# Altium project EFR32xG22_LC_REF_DES_A02.PrjPCB
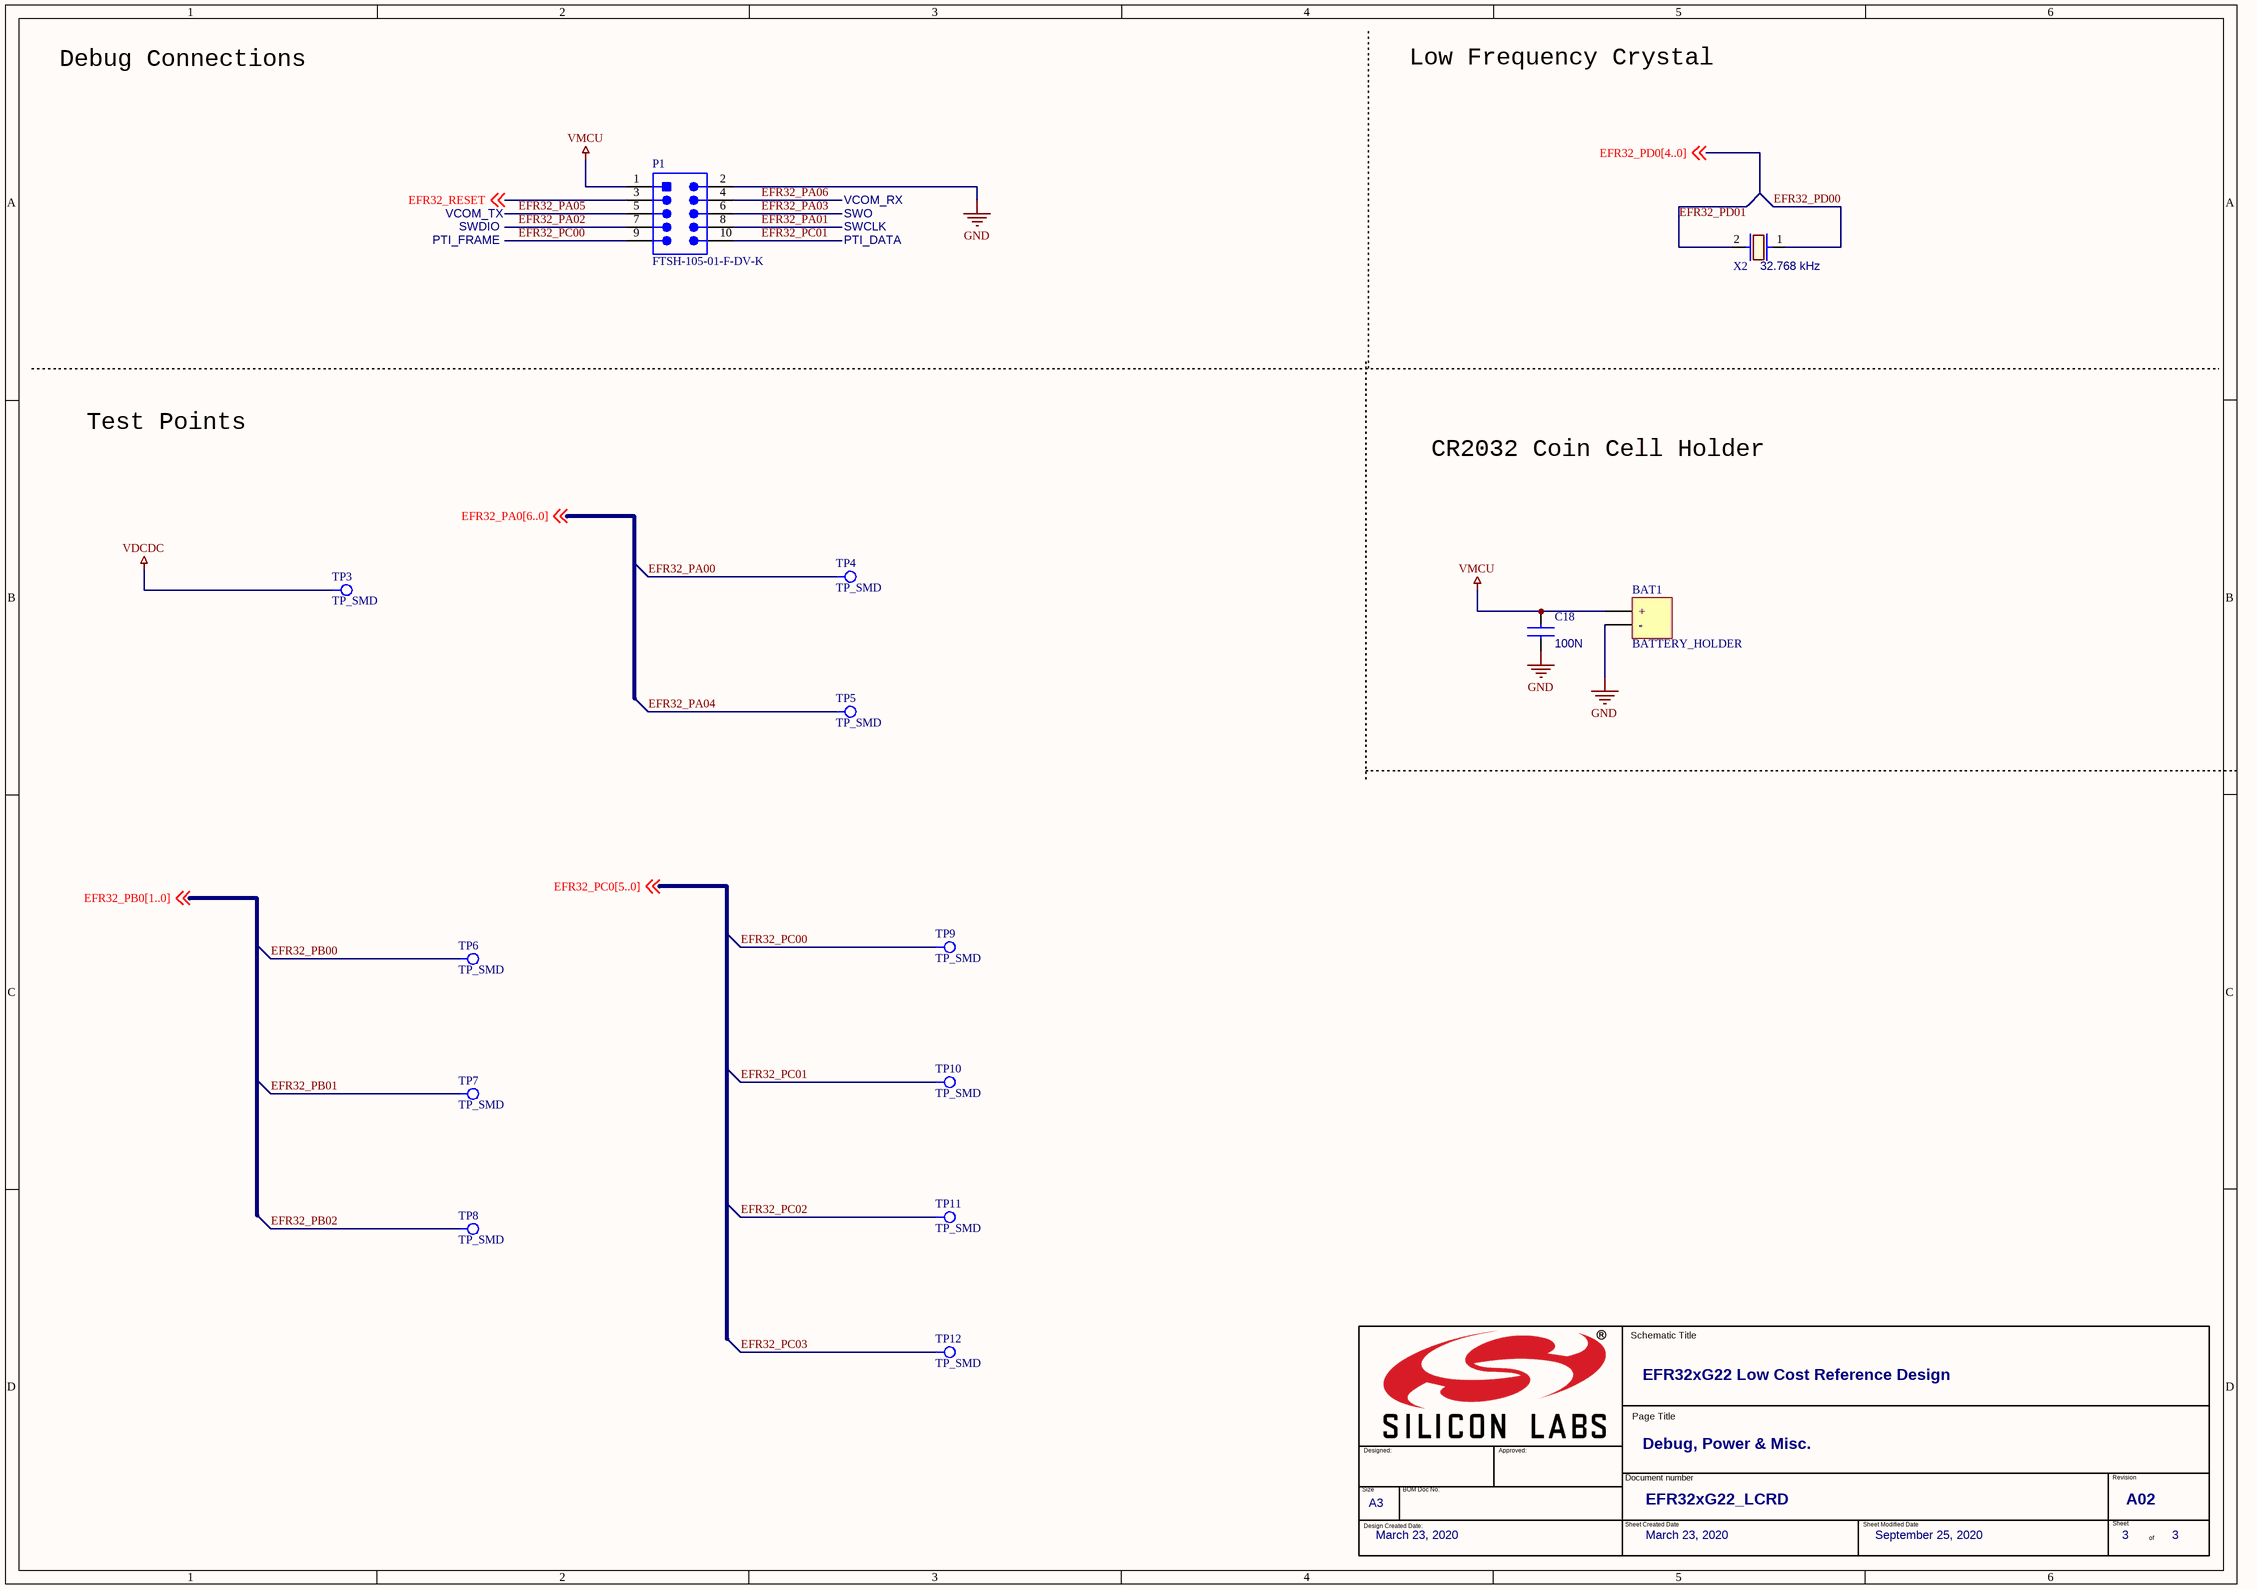
[diagram p0: EFR32xG22_LC_REF_DES_A02_TP_Connectors.SchDoc]
AssemblyPrintName: EFR32xG22_LC_REF_DES_A02_ASM; Board_No: EFR32xG22_LCRD; Board_Rev: A02; CamPrintName: EFR32xG22_LC_REF_DES_A01_CAM; ClassName: PCB Only; Company_Address_1: 343 Congress St; Company_Address_2: 4th Floor; Company_Address_3: Boston, MA 02210; Company_Design_Group: IoT Wireless Hardware Applications; Company_Tel: 617-951-0200; Company_Web_Site: www.silabs.com; FabPrintName: EFR32xG22_LC_REF_DES_A01_FAB; PCBLayoutName: EFR32xG22_LC_REF_DES_A01; SchematicName: EFR32xG22_LC_REF_DES_A02_SCH; Title: EFR32xG22 Low Cost Reference Design; VariantName: EFR32xG22_LC_REF_DES_A01; XYReportName: EFR32xG22_LC_REF_DES_A02_XYR
3 sheets, 57 parts. Net scope: global (net labels, ports and power ports of the same name join across sheets).
Board file: EFR32xG22_LC_REF_DES_A01.PcbDoc
Sheets:
  EFR32xG22_LC_REF_DES_A02_TP_Connectors.SchDoc
  EFR32xG22_LC_REF_DES_A02_Main.SchDoc
  EFR32xG22_LC_REF_DES_A02_Cover.SchDoc

## Sheet EFR32xG22_LC_REF_DES_A02_TP_Connectors.SchDoc: EFR32xG22 Low Cost Reference Design
size 420 x 297 mm

### Parts
(Parts that share a designator on the sheet are numbered #1, #2 ... from top to bottom, then left to right.)
*?#1  Page Title: Debug, Power & Misc.  Page Size: A3  Title: EFR32xG22 Low Cost Reference Design  Page Number: 3  (hidden comment: TitleBlock_EnergyMicro_A3)  (graphical)
BAT1  BATTERY_HOLDER
C18  100N  [C_0402]
P1  FTSH-105-01-F-DV-K  [SMTC-FTSH-105-01-L-DV-K_V]
TP3  TP_SMD  [TP]
TP4  TP_SMD  [TP]
TP5  TP_SMD  [TP]
TP6  TP_SMD  [TP]
TP7  TP_SMD  [TP]
TP8  TP_SMD  [TP]
TP9  TP_SMD  [TP]
TP10  TP_SMD  [TP]
TP11  TP_SMD  [TP]
TP12  TP_SMD  [TP]
X2  32.768 kHz  [LFXO]

### Nets
GND: BAT1.2(-) C18.2 P1.2
VDCDC: TP3.1(TP)
VMCU: BAT1.1(+) C18.1 P1.1
EFR32_PA00: TP4.1(TP)
EFR32_PA01: P1.8
EFR32_PA02: P1.7
EFR32_PA03: P1.6
EFR32_PA04: TP5.1(TP)
EFR32_PA05: P1.5
EFR32_PA06: P1.4
EFR32_PB00: TP6.1(TP)
EFR32_PB01: TP7.1(TP)
EFR32_PB02: TP8.1(TP)
EFR32_PC00: P1.9 TP9.1(TP)
EFR32_PC01: P1.10 TP10.1(TP)
EFR32_PC02: TP11.1(TP)
EFR32_PC03: TP12.1(TP)
EFR32_PD00: X2.1
EFR32_PD01: X2.2
EFR32_RESET: P1.3 ; off-sheet EFR32_RESET

### Notes on the sheet
- Debug Connections
- Low Frequency Crystal
- PTI_FRAME
- VCOM_TX
- SWDIO
- VCOM_RX
- SWO
- SWCLK
- PTI_DATA
- Test Points
- CR2032 Coin Cell Holder
- March 23, 2020
- EFR32xG22_LCRD
- September 25, 2020
- A02
- (in symbol TitleBlock_EnergyMicro_A3) Schematic Title; Page Title; Designed:; Approved:; Document number; Revision; Size; BOM Doc No:; Design Created Date:; Sheet Created Date; Sheet Modified Date; Sheet; of

### Library data of the parts
*?#1 = TitleBlock_EnergyMicro_A3: OrgName: Silicon Labs; Page Count: 3
C18 = C0201
P1 = CMP-2000-05352-1: Male Header, Pitch 1.27 mm, 2 x 5 Position, Height 6.12 mm, RoHS, Tube; Manufacturer: Samtec; Number of Positions: 10; Connector Type: Header,Shrouded; Number of Positions Loaded: All; Row Spacing: 0.050"(1.27mm); Fastening Type: -; Package Reference: FTSH-105-01-L-DV-K; Termination: Solder; Package URL: http://suddendocs.samtec.com/prints/ftsh-1xx-xx-xxx-dv-xxx-footprint.pdf; Number of Rows: 2; Contact Finish Thickness: 3µin(0.08µm); Contact Type: MalePin; Manufacturer URL: http://www.samtec.com/; Contact Mating Length: 0.120"(3.05mm); Pitch: 0.050"(1.27mm); Series: FTSH; Features: -; Contact Finish: Gold; Color: Black; Family: RectangularConnectors-Headers,MalePins; Datasheet URL: http://suddendocs.samtec.com/prints/ftsh-1xx-xx-xxx-dv-xxx-mkt.pdf; Package Description: Male Header, Pitch 1.27 mm, 2 x 5 Position, Height 5.97 mm, Tail Length 4.32 mm; Mounting Type: SurfaceMount; Datasheet Version: Rev. ET, 10/1995; Category: Connectors,Interconnects; Packaging: Tube
X2 = LFXO: Mfg #: CM8V-T1A, 32768Hz, 12.5pF, +/- 20ppm; Mfg: Micro Crystal AG; Price_1K: 0.3

## Sheet EFR32xG22_LC_REF_DES_A02_Main.SchDoc: EFR32xG22 Low Cost Reference Design
size 420 x 297 mm
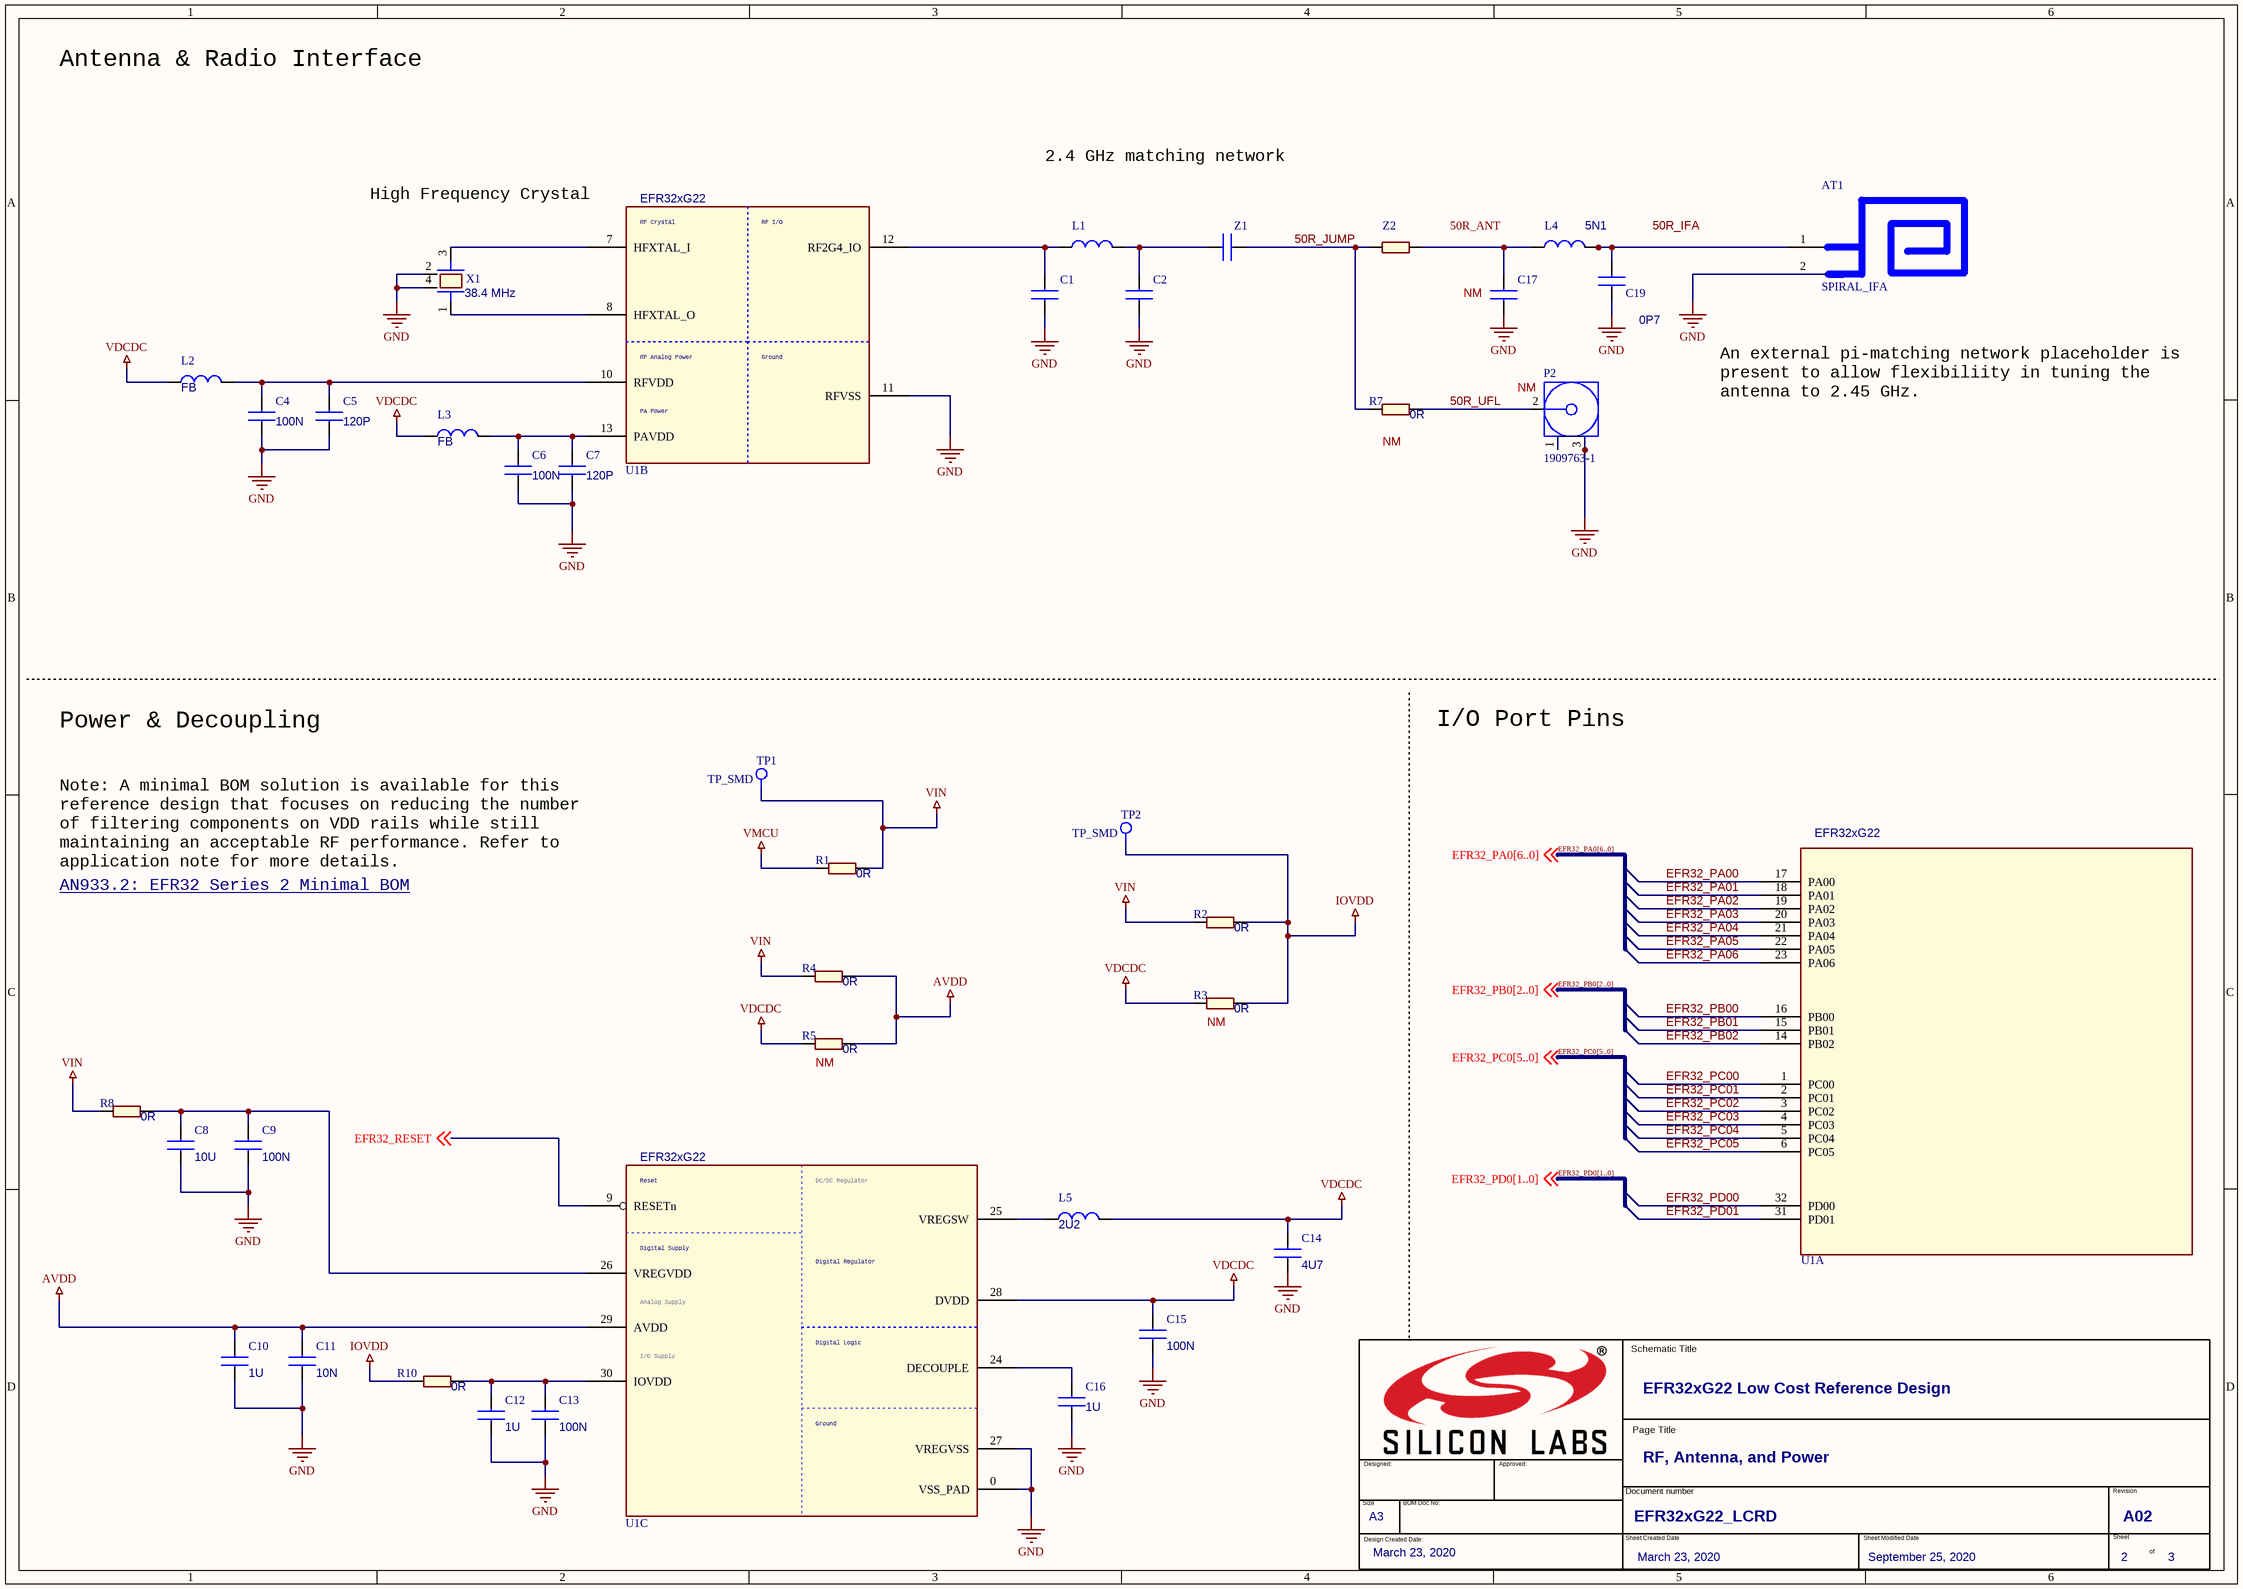
[diagram p1: EFR32xG22_LC_REF_DES_A02_Main.SchDoc]

### Parts
(Parts that share a designator on the sheet are numbered #1, #2 ... from top to bottom, then left to right.)
*?#2  Page Title: RF, Antenna, and Power  Page Size: A3  Title: EFR32xG22 Low Cost Reference Design  Page Number: 2  Page Count: 3  Design Create Date: March 23, 2020  (hidden comment: TitleBlock_EnergyMicro_A3)  (graphical)
AT1  SPIRAL_IFA  [SPIRAL_IFA_INV]
C1  (no value)  [0201]
C2  (no value)  [0201]
C4  100N  [C_0402]
C5  120P  [0201]
C6  100N  [C_0402]
C7  120P  [0201]
C8  10U  [0805]
C9  100N  [C_0402]
C10  1U  [C_0603]
C11  10N  [0201]
C12  1U  [C_0603]
C13  100N  [C_0402]
C14  4U7  [C_0603]
C15  100N  [C_0402]
C16  1U  [C_0603]
C17  1P3  [0201]  (value not drawn)
C19  0P7  [0201]
L1  (no value)  [0201]
L2  FB  [0402_Taiyo]
L3  FB  [0402_Taiyo]
L4  5N1  [0201]
L5  2U2  [L_0603]
P2  1909763-1  [TECO-1909763-1_V]
R1  0R  [0201]
R2  0R  [0201]
R3  0R  [0201]
R4  0R  [0201]
R5  0R  [0201]
R7  0R  [0201]
R8  0R  [0201]
R10  0R  [0201]
TP1  TP_SMD  [TP]
TP2  TP_SMD  [TP]
U1  EFR32xG22  [QFN32]  (parts A,B,C of 3)
X1  38.4 MHz  [HFXO_TZ2205E]
Z1  (no value)  [0201]
Z2  (no value)  [0201]

### Nets
AVDD: C10.1 C11.1 R4.2 R5.2 U1.29(AVDD)
GND: AT1.2(GND) C1.2 C2.2 C4.2 C5.2 C6.2 C7.2 C8.2 C9.2 C10.2 C11.2 C12.2 C13.2 C14.2 C15.2 C16.2 C17.2 C19.1 P2.1 P2.3 U1.0(VSS_PAD) U1.11(RFVSS) U1.27(VREGVSS) X1.2 X1.4
IOVDD: R2.2 R3.2 R10.1 TP2.1(TP)
VDCDC: C14.1 C15.1 L2.1 L3.1 L5.2 R3.1 R5.1 U1.28(DVDD)
VIN: R1.2 R2.1 R4.1 R8.1 TP1.1(TP)
VMCU: R1.1
50R_JUMP: R7.1 Z1.2 Z2.1
50R_UFL: P2.2 R7.2
EFR32_PA00: U1.17(PA00)
EFR32_PA01: U1.18(PA01)
EFR32_PA02: U1.19(PA02)
EFR32_PA03: U1.20(PA03)
EFR32_PA04: U1.21(PA04)
EFR32_PA05: U1.22(PA05)
EFR32_PA06: U1.23(PA06)
EFR32_PB00: U1.16(PB00)
EFR32_PB01: U1.15(PB01)
EFR32_PB02: U1.14(PB02)
EFR32_PC00: U1.1(PC00)
EFR32_PC01: U1.2(PC01)
EFR32_PC02: U1.3(PC02)
EFR32_PC03: U1.4(PC03)
EFR32_PC04: U1.5(PC04)
EFR32_PC05: U1.6(PC05)
EFR32_PD00: U1.32(PD00)
EFR32_PD01: U1.31(PD01)
EFR32_RESET: U1.9(RESETn) ; off-sheet EFR32_RESET
NetC1_1: C1.1 L1.1 U1.12(RF2G4_IO)
NetC2_1: C2.1 L1.2 Z1.1
NetC4_1: C4.1 C5.1 L2.2 U1.10(RFVDD)
NetC6_1: C6.1 C7.1 L3.2 U1.13(PAVDD)
NetC8_1: C8.1 C9.1 R8.2 U1.26(VREGVDD)
NetC12_1: C12.1 C13.1 R10.2 U1.30(IOVDD)
NetC16_1: C16.1 U1.24(DECOUPLE)
NetC17_1: C17.1 L4.1 Z2.2
NetC19_2: C19.2 L4.2
NetL5_1: L5.1 U1.25(VREGSW)
NetU1_7: U1.7(HFXTAL_I) X1.3
NetU1_8: U1.8(HFXTAL_O) X1.1

Not connected (* = marked no-connect by the designer): AT1 1(RF)

### Buses and harness runs
bus EFR32_PA0[6..0]
bus EFR32_PB0[2..0]
bus EFR32_PC0[5..0]
bus EFR32_PD0[1..0]

### Notes on the sheet
- Antenna & Radio Interface
- 2.4 GHz matching network
- High Frequency Crystal
- (near C17) NM
- (near P2) NM
- (near R7) NM
- An external pi-matching network placeholder is present to allow flexibiliity in tuning the antenna to 2.45 GHz.
- Power & Decoupling
- I/O Port Pins
- Note: A minimal BOM solution is available for this reference design that focuses on reducing the number of filtering components on VDD rails while still maintaining an acceptable RF performance. Refer to                                       application note for more details.
- AN933.2: EFR32 Series 2 Minimal BOM
- (near R5) NM
- (near R3) NM
- EFR32xG22_LCRD
- A02
- March 23, 2020
- September 25, 2020
- Labels drawn without touching a wire or pin: 50R_ANT, 50R_IFA
- (in symbol EFR32xG22-2.4GHZ-QFN32, part B) RF Crystal; RF I/O; RF Analog Power; Ground; PA Power
- (in symbol EFR32xG22-2.4GHZ-QFN32, part C) Reset; DC/DC Regulator; Digital Supply; Digital Regulator; Analog Supply; Digital Logic; I/O Supply; Ground
- (in symbol TitleBlock_EnergyMicro_A3) Schematic Title; Page Title; Designed:; Approved:; Document number; Revision; Size; BOM Doc No:; Design Created Date:; Sheet Created Date; Sheet Modified Date; Sheet; of

### Library data of the parts
*?#2 = TitleBlock_EnergyMicro_A3: OrgName: Silicon Labs
C1 C2 C11 C13 C15 C17 C19 Z1 = C0201
  C2 C17: Value: *
C4-C9 C12 C14 C16 = C0402
C10 = C0805
L1 L4 = L0201
L2 L3 L5 = L0402
P2 = CMP-2000-07505-1: Ultra Miniature Coaxial Connector Jack, 60 V, 50 Ohm, -40 to 90 degC, RoHS, Tape and Reel; Manufacturer: TE Connectivity; Gender: Female; PCB Mounting Orientation: Vertical; Body Material: LiquidCrystalPolymer; Case\/Package: SMD/SMT; Impedance: 50Ohm; Max Frequency: 6GHz; Body Plating: Gold; Dielectric Material: Polymer; Orientation: Straight; Mount: SurfaceMount; Length: 3mm; Packaging: TapeandReel; Connector Type: Jack; Lead Free: LeadFree; Package Quantity: 1; Termination: SMD/SMT; Contact Material: CopperAlloy; Fastening Type: Pull; RoHSCompliant: true; Max Operating Temperature: 90degC; Datasheet URL: http://www.te.com/commerce/DocumentDelivery/DDEController?Action=srchrtrv&DocNm=1909763&DocType=Customer+Drawing&DocLang=English; Contact Plating: Gold; Mounting Technology: SurfaceMount; Package Reference: TECO-1909763-1; Insulation Material: Thermoplastic; Min Operating Temperature: -40degC; Manufacturer URL: http://www.te.com/; ELV: Compliant; Datasheet Version: Rev. B2, 11/2015; Radiation Hardening: No; Package Description: 3-Pin Surface Mount Device, Body 2.6 x 2.6 mm; Housing Colour: Beige
R1-R5 R7 R8 R10 Z2 = R0201: Price_1K: 0.005
U1 = EFR32xG22-2.4GHZ-QFN32: MFG: Silicon Labs; MFG #: <val>
X1 = HFXO: Mfg #: KDS_DSX211SH_2016; Mfg: KDS; Price_1K: 0.512

## Sheet EFR32xG22_LC_REF_DES_A02_Cover.SchDoc: EFR32xG22 Low Cost Reference Design
size 420 x 297 mm
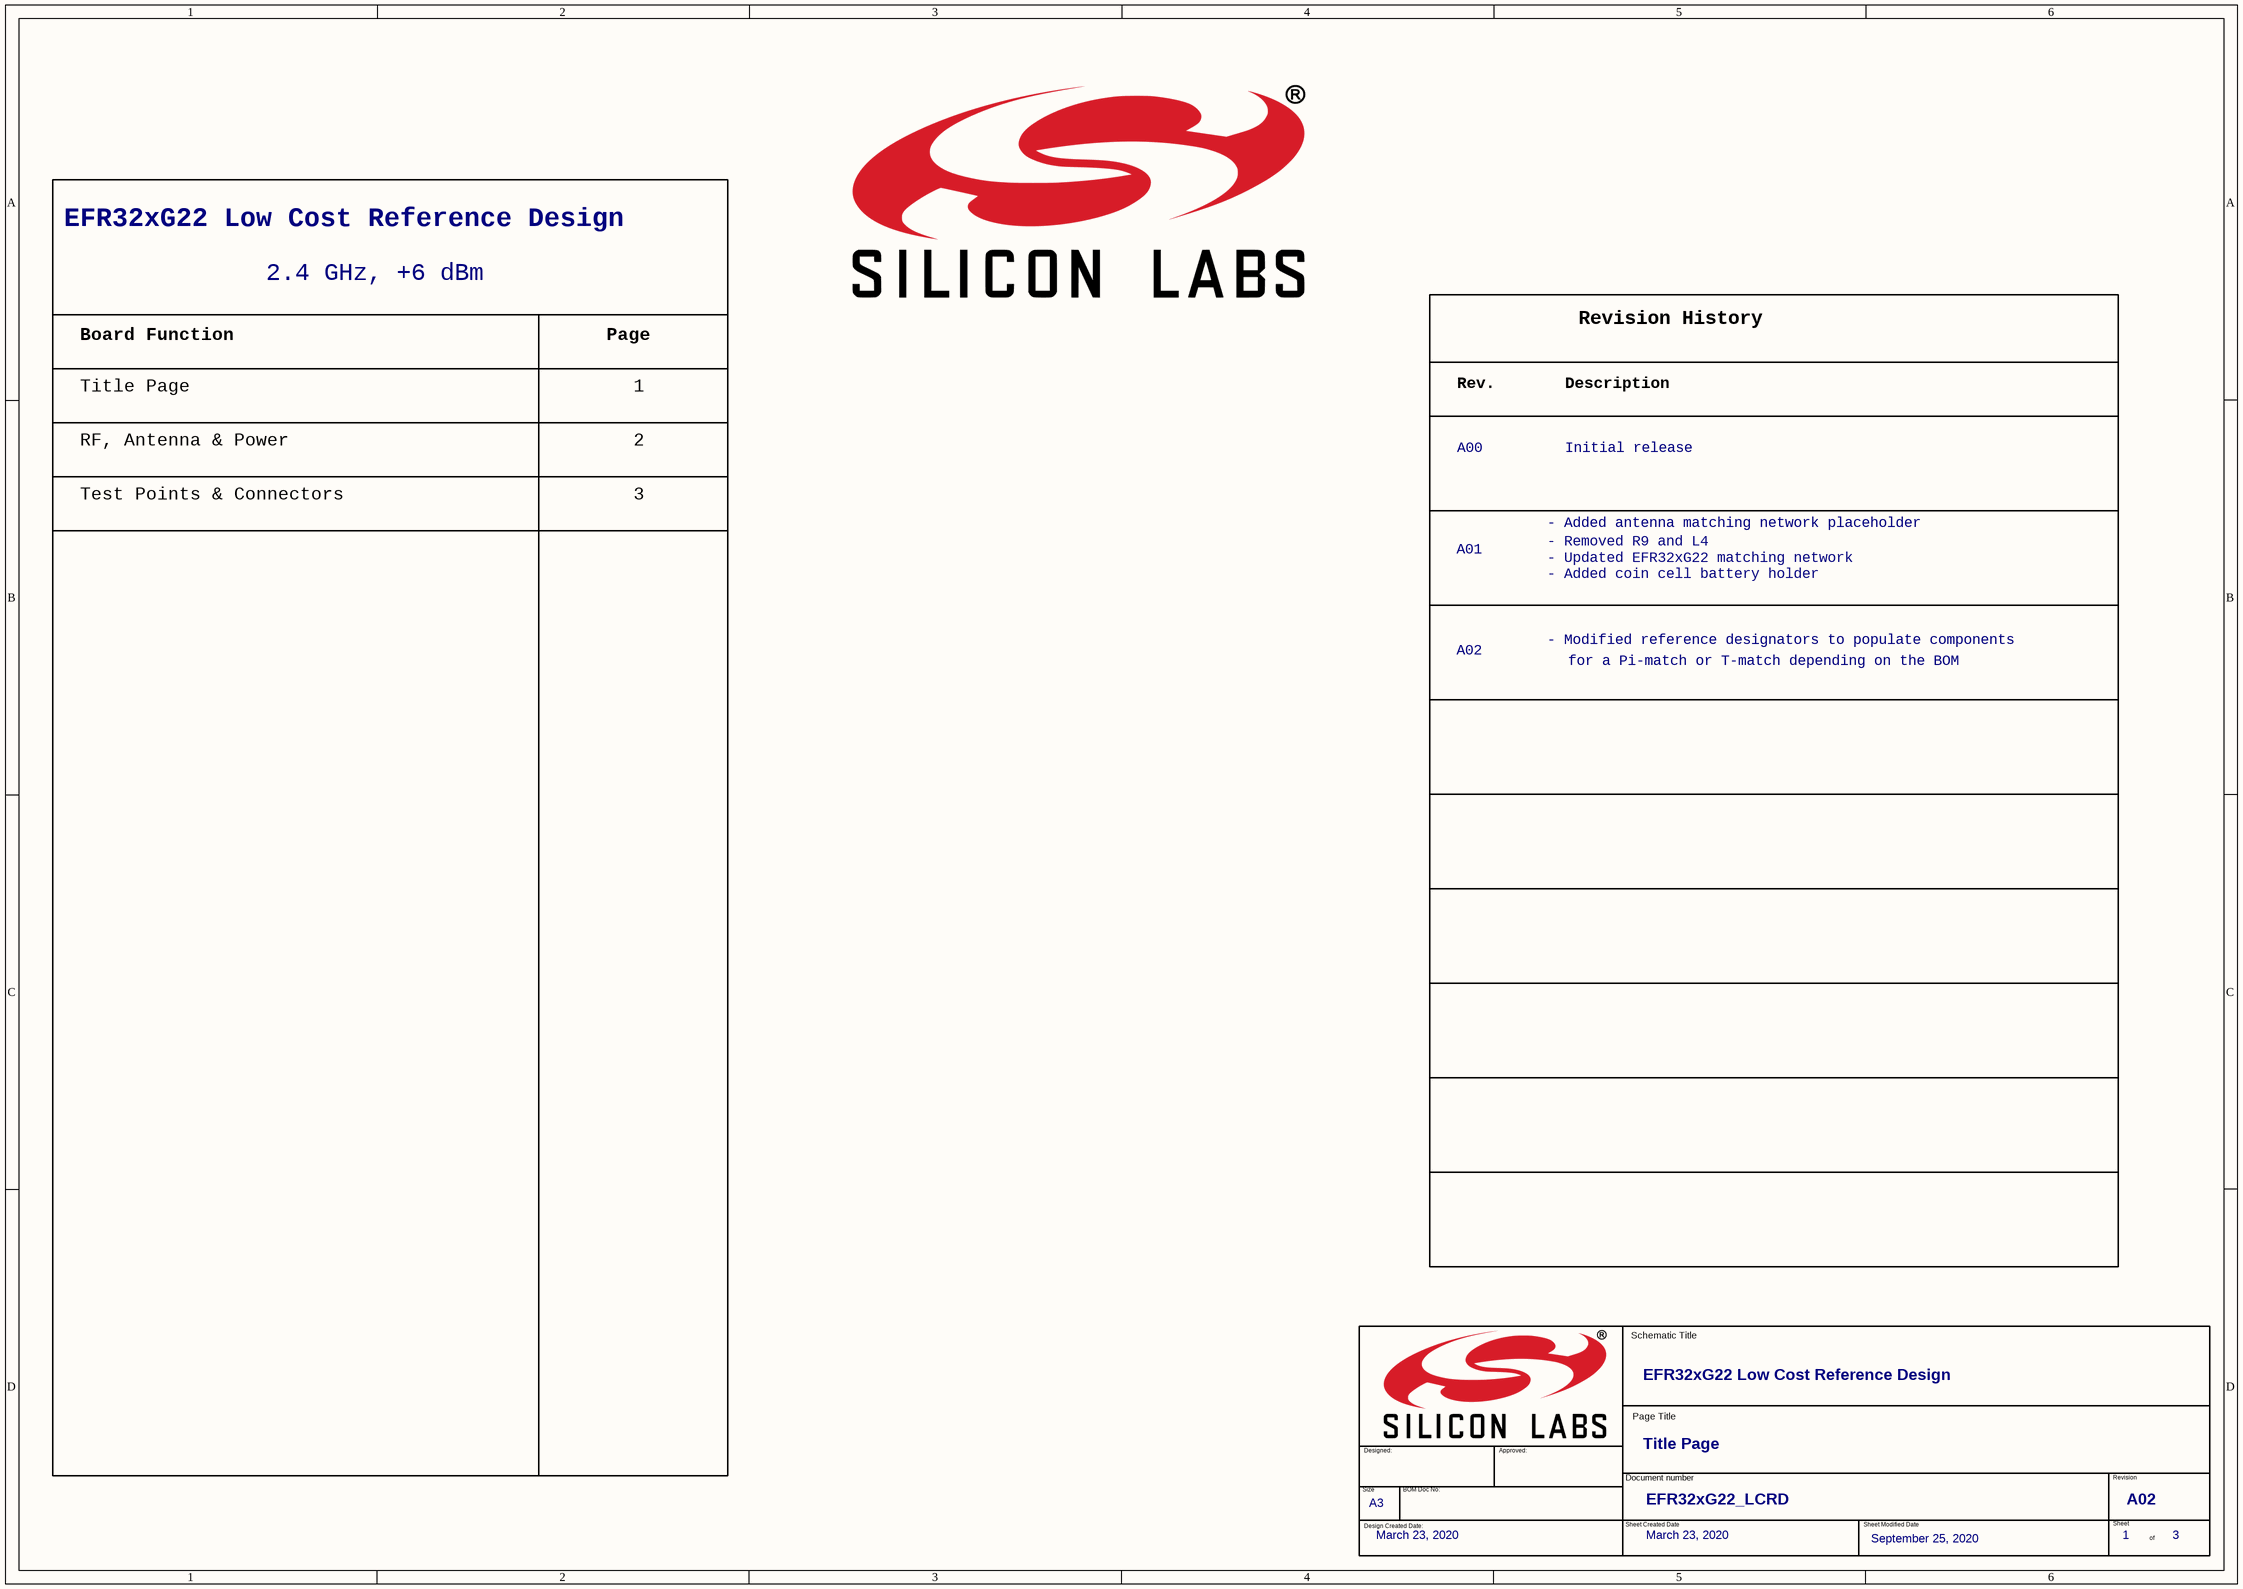
[diagram p2: EFR32xG22_LC_REF_DES_A02_Cover.SchDoc]

### Parts
(Parts that share a designator on the sheet are numbered #1, #2 ... from top to bottom, then left to right.)
*?#3  Header A: EFR32xG22 Low Cost Reference Design  (hidden comment: Toc_Header)  (graphical)
*?#4  Rev1: A00  (hidden comment: Rev_History)  (graphical)
*?#5  Page Title: Title Page  Page Size: A3  Title: EFR32xG22 Low Cost Reference Design  Page Number: 1  Page Count: 3  (hidden comment: TitleBlock_EnergyMicro_A3)  (graphical)

### Notes on the sheet
- 2.4 GHz, +6 dBm
- Board Function
- Title Page
- Page
- 1
- RF, Antenna & Power
- 2
- Initial release
- Test Points & Connectors
- 3
- - Added antenna matching network placeholder
- A01
- - Removed R9 and L4
  - Updated EFR32xG22 matching network
  - Added coin cell battery holder
- A02
- - Modified reference designators to populate components
- for a Pi-match or T-match depending on the BOM
- March 23, 2020
- EFR32xG22_LCRD
- September 25, 2020
- (in symbol Rev_History) Revision History; Rev.; Description
- (in symbol TitleBlock_EnergyMicro_A3) Schematic Title; Page Title; Designed:; Approved:; Document number; Revision; Size; BOM Doc No:; Design Created Date:; Sheet Created Date; Sheet Modified Date; Sheet; of

### Library data of the parts
*?#3 = Toc_Header: Title: EFR32xG21 2.4 GHz 20 dBm Radio Board; RevCode: A00; OrgName: Silicon Labs; Page Number: 1; Page Count: 4; Doc: BRD4180A
*?#4 = Rev_History: Initial release; Doc: BRD4180A; Title: EFR32xG21 2.4 GHz 20 dBm Radio Board; OrgAddr2: JNO; OrgAddr1: JSH; OrgName: Silicon Labs; Page Number: 1; Page Count: 5; RevCode: A00
*?#5 = TitleBlock_EnergyMicro_A3: OrgName: Silicon Labs

## Nets that join several sheets
GND: EFR32xG22_LC_REF_DES_A02_TP_Connectors (BAT1.2 C18.2 P1.2), EFR32xG22_LC_REF_DES_A02_Main (25 pins)
VDCDC: EFR32xG22_LC_REF_DES_A02_TP_Connectors (TP3.1), EFR32xG22_LC_REF_DES_A02_Main (8 pins)
VMCU: EFR32xG22_LC_REF_DES_A02_TP_Connectors (BAT1.1 C18.1 P1.1), EFR32xG22_LC_REF_DES_A02_Main (R1.1)
EFR32_PA00: EFR32xG22_LC_REF_DES_A02_TP_Connectors (TP4.1), EFR32xG22_LC_REF_DES_A02_Main (U1.17)
EFR32_PA01: EFR32xG22_LC_REF_DES_A02_TP_Connectors (P1.8), EFR32xG22_LC_REF_DES_A02_Main (U1.18)
EFR32_PA02: EFR32xG22_LC_REF_DES_A02_TP_Connectors (P1.7), EFR32xG22_LC_REF_DES_A02_Main (U1.19)
EFR32_PA03: EFR32xG22_LC_REF_DES_A02_TP_Connectors (P1.6), EFR32xG22_LC_REF_DES_A02_Main (U1.20)
EFR32_PA04: EFR32xG22_LC_REF_DES_A02_TP_Connectors (TP5.1), EFR32xG22_LC_REF_DES_A02_Main (U1.21)
EFR32_PA05: EFR32xG22_LC_REF_DES_A02_TP_Connectors (P1.5), EFR32xG22_LC_REF_DES_A02_Main (U1.22)
EFR32_PA06: EFR32xG22_LC_REF_DES_A02_TP_Connectors (P1.4), EFR32xG22_LC_REF_DES_A02_Main (U1.23)
EFR32_PB00: EFR32xG22_LC_REF_DES_A02_TP_Connectors (TP6.1), EFR32xG22_LC_REF_DES_A02_Main (U1.16)
EFR32_PB01: EFR32xG22_LC_REF_DES_A02_TP_Connectors (TP7.1), EFR32xG22_LC_REF_DES_A02_Main (U1.15)
EFR32_PB02: EFR32xG22_LC_REF_DES_A02_TP_Connectors (TP8.1), EFR32xG22_LC_REF_DES_A02_Main (U1.14)
EFR32_PC00: EFR32xG22_LC_REF_DES_A02_TP_Connectors (P1.9 TP9.1), EFR32xG22_LC_REF_DES_A02_Main (U1.1)
EFR32_PC01: EFR32xG22_LC_REF_DES_A02_TP_Connectors (P1.10 TP10.1), EFR32xG22_LC_REF_DES_A02_Main (U1.2)
EFR32_PC02: EFR32xG22_LC_REF_DES_A02_TP_Connectors (TP11.1), EFR32xG22_LC_REF_DES_A02_Main (U1.3)
EFR32_PC03: EFR32xG22_LC_REF_DES_A02_TP_Connectors (TP12.1), EFR32xG22_LC_REF_DES_A02_Main (U1.4)
EFR32_PD00: EFR32xG22_LC_REF_DES_A02_TP_Connectors (X2.1), EFR32xG22_LC_REF_DES_A02_Main (U1.32)
EFR32_PD01: EFR32xG22_LC_REF_DES_A02_TP_Connectors (X2.2), EFR32xG22_LC_REF_DES_A02_Main (U1.31)
EFR32_RESET: EFR32xG22_LC_REF_DES_A02_TP_Connectors (P1.3), EFR32xG22_LC_REF_DES_A02_Main (U1.9)